# Altium schematic sheet PA_classD.SchDoc
size A4
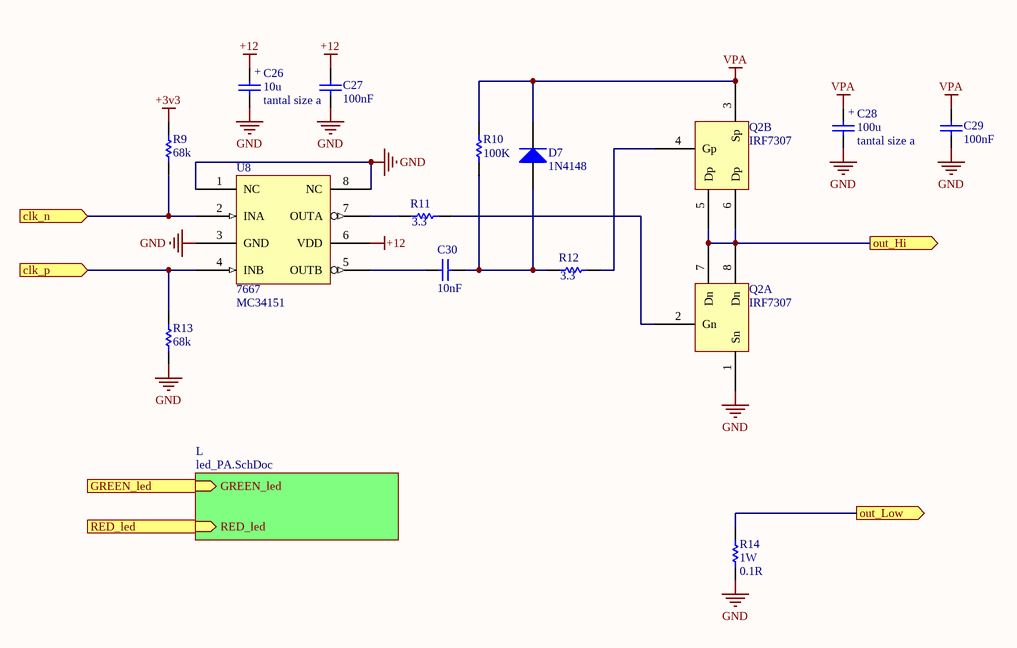
[diagram p0: PA_classD.SchDoc]

## Parts
C26  tantal size a  value 10u  [CAPP 1206 (3216X18L) Size A]
C27  value 100nF  [SMD_CAP_0805]  (hidden comment: Cap)
C28  tantal size a  value 100u  [CAPP 1206 (3216X18L) Size A]
C29  value 100nF  [SMD_CAP_0805]  (hidden comment: Cap)
C30  value 10nF  [SMD_CAP_0805]  (hidden comment: Cap)
D7  1N4148  [LL4148]
Q2  IRF7307  [SO8_M]  (parts A,B of 2)
R9  value 68k  [RES 0805 (2012X06L)]  (hidden comment: Res1)
R10  value 100K  [RES 0805 (2012X06L)]  (hidden comment: Res1)
R11  value 3.3  [RES 0805 (2012X06L)]  (hidden comment: Res1)
R12  value 3.3  [RES 0805 (2012X06L)]  (hidden comment: Res1)
R13  value 68k  [RES 0805 (2012X06L)]  (hidden comment: Res1)
R14  1W  value 0.1R  [Axial 1W  7_0mm]
U8  7667  [SO8_M]

## Sub-sheets
L = led_PA.SchDoc: GREEN_led (in), RED_led (in)

## Ports
clk_n (in), clk_p (in), GREEN_led (in), out_Hi (out), out_Low (out), RED_led (in)

## Nets
+3v3: R9.1
+12: C26.+ C27.1 U8.6(VDD)
GND: C26.- C27.2 C28.- C29.2 Q2.1(Sn) R13.2 R14.1 U8.1(NC) U8.3(GND) U8.8(NC)
VPA: C28.+ C29.1 D7.2(K) Q2.3(Sp) R10.1
clk_n: R9.2 U8.2(INA) ; port clk_n
clk_p: R13.1 U8.4(INB) ; port clk_p
GREEN_led: port GREEN_led, sheet L/GREEN_led
out_Hi: Q2.5(Dp) Q2.6(Dp) Q2.7(Dn) Q2.8(Dn) ; port out_Hi
out_Low: R14.2 ; port out_Low
RED_led: port RED_led, sheet L/RED_led
NetC30_1: C30.1 U8.5(OUTB)
NetC30_2: C30.2 D7.1(A) R10.2 R12.2
NetQ2_2: Q2.2(Gn) R11.1
NetQ2_4: Q2.4(Gp) R12.1
NetR11_2: R11.2 U8.7(OUTA)

## Notes on the sheet
- (near U8) MC34151

## Library data of the parts
C26 C28 = Cap Pol: pin to pad: +>1 ->2
C27 C29 C30 = Cap ceramic: CAP-100Nf
D7 = Diode 1N4148: High Conductance Fast Diode; Published: 8-Jun-2000; LatestRevisionDate: 17-Jul-2002; LatestRevisionNote: Re-released for DXP Platform.; DatasheetVersion: 1997; PackageReference: DO-35; Publisher: Altium Limited; PackageDescription: Diode, Axial; Body 3.8 x 1.9 mm (LxDia. max), Lead Dia. 0.53 mm (max); Code_JEDEC: DO-204-AH; ComponentLink1Description: Manufacturer Link; ComponentLink1URL: http://www.fairchildsemi.com/; ComponentLink2Description: Datasheet; ComponentLink2URL: http://www.fairchildsemi.com/ds/1N%2F1N4148.pdf
Q2 = IRF7106
R9-R14 = Res1: Resistor; Published: 8-Jun-2000; LatestRevisionDate: 17-Jul-2002; LatestRevisionNote: Re-released for DXP Platform.; PackageReference: AXIAL-0.3; Publisher: Altium Limited; PackageDescription: Axial Device, Thru-Hole; 2 Leads; 0.3 in Pin Spacing
U8 = ICL7667